# Altium schematic sheet MCU_LCDGlass_Symbol.SchDoc: MCU_LCDGlassl
size A3; DocumentNumber: MB1144; Revision: C-02; SheetNumber: 2; SheetTotal: 25; PageSetup: Record=PageOptions|CenterHorizontal=True|CenterVertical=True|PrintScale=1.01|XCorrection=1.00|YCorrection=1.00|PrintKind=1|BorderSize=5000000|LeftOffset=0|BottomOffset=0|Orientation=2|PaperLength=1000|PaperWidth=1000|Scale=100|PaperSource=264|PrintQuality=600|MediaType=1|DitherType=10|PaperKind=A3|PrintScaleMode=1; Project: STM32L476G-EVAL; ModifiedDate: 9/23/2015
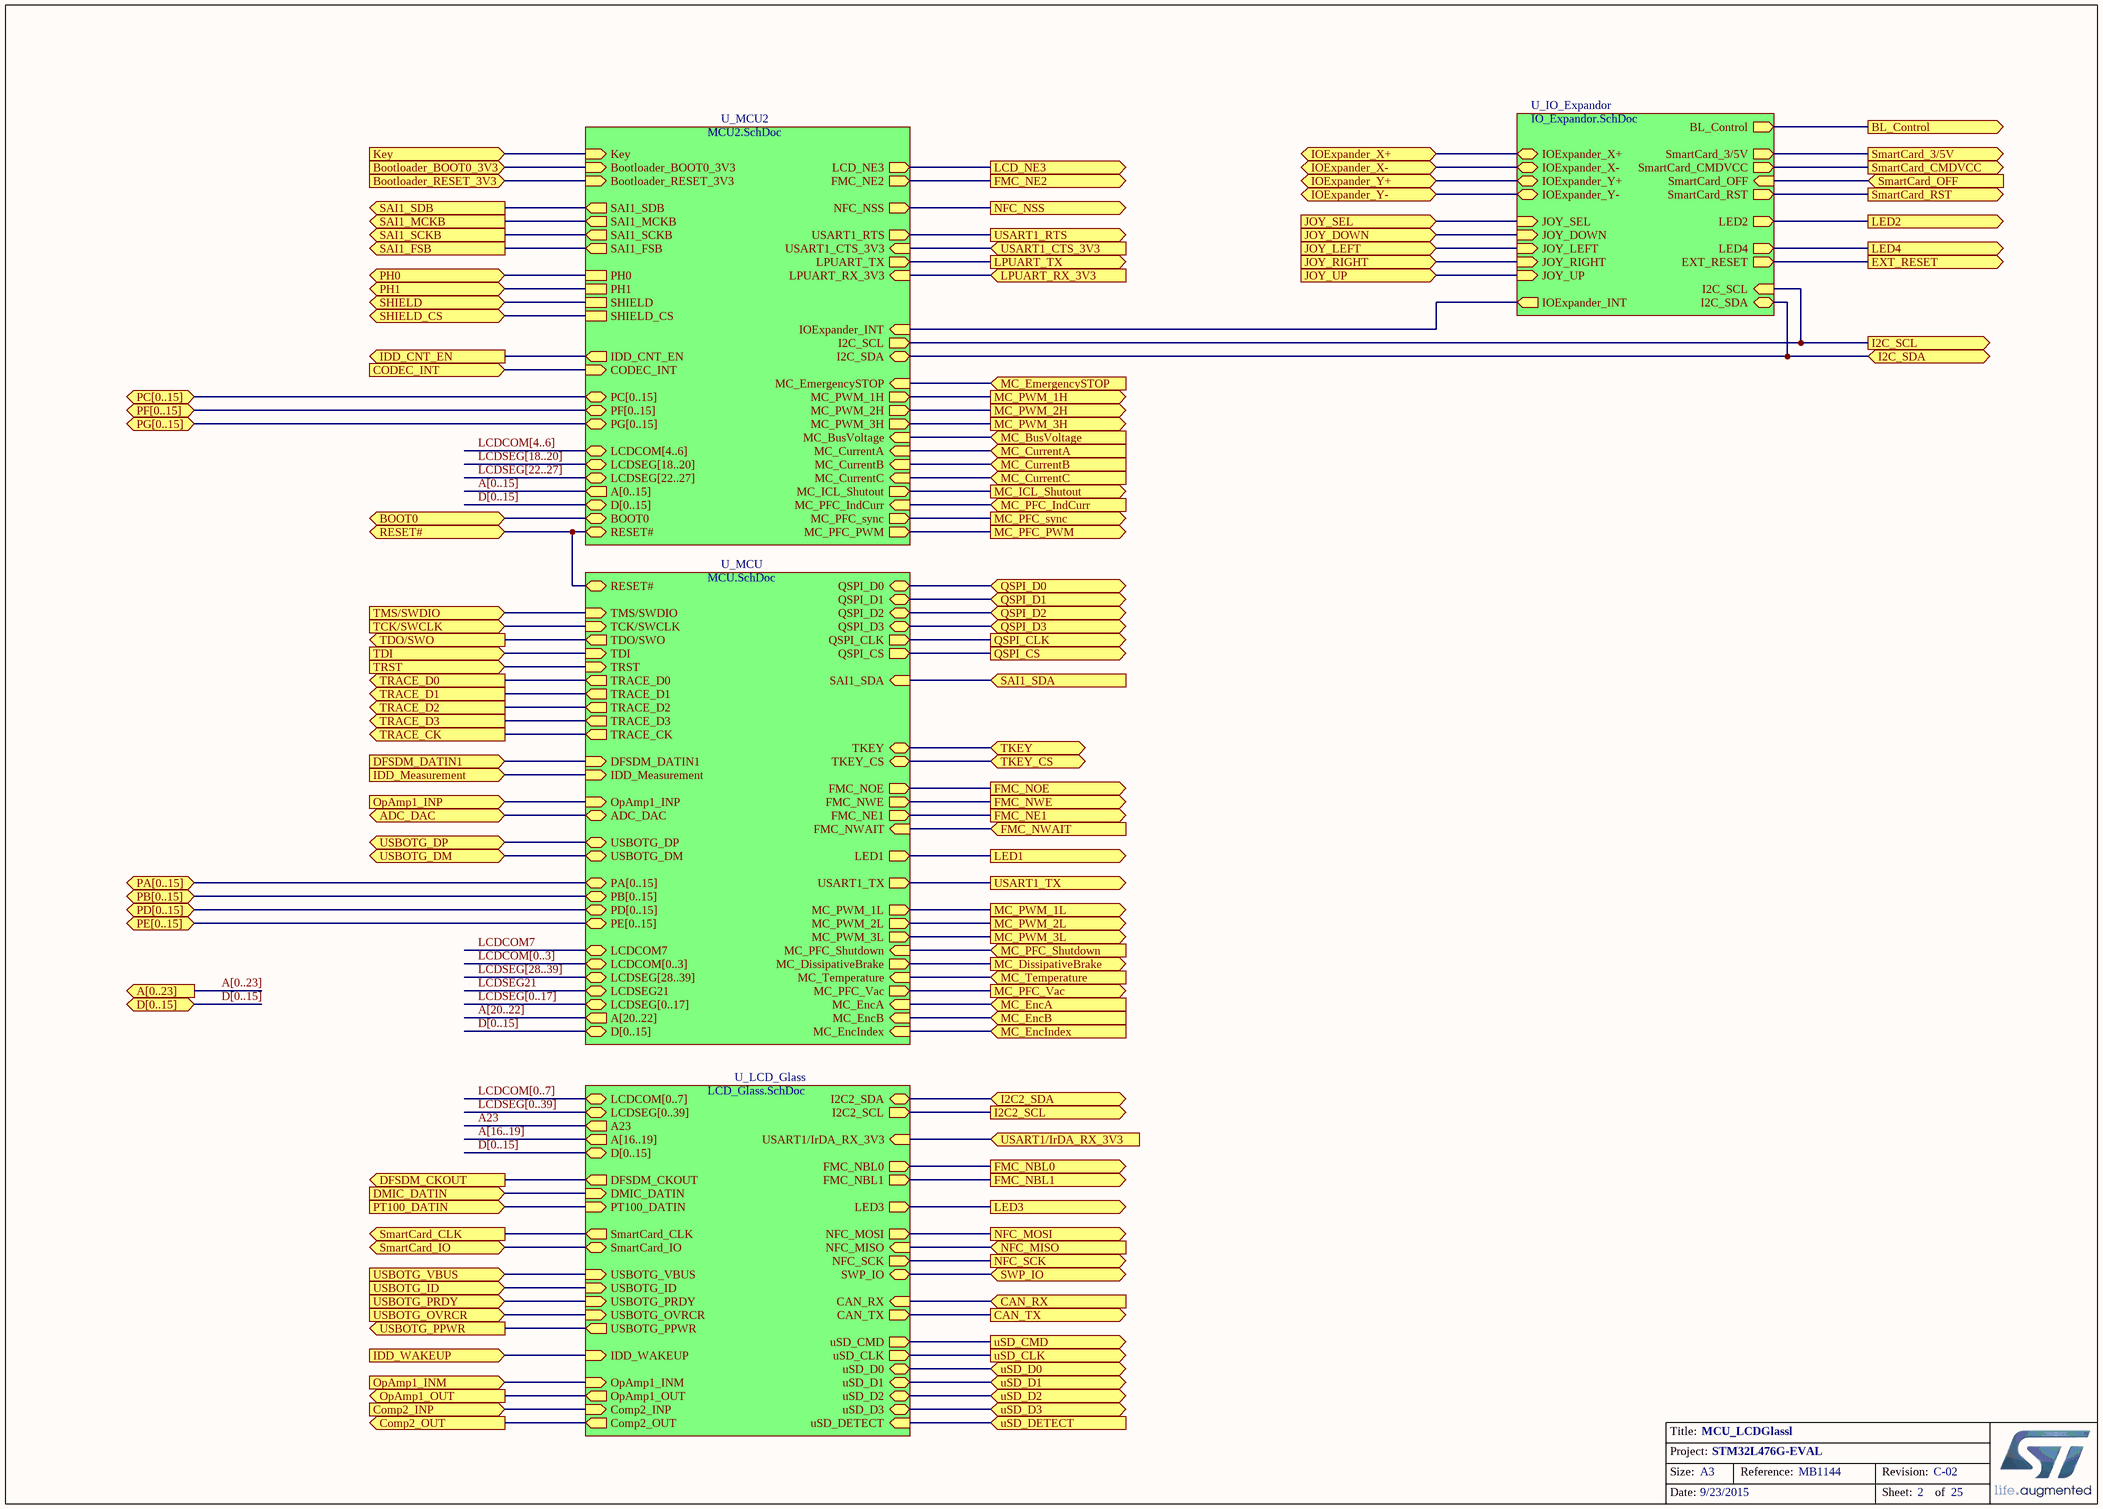
[diagram p0: MCU_LCDGlass_Symbol.SchDoc]

## Sub-sheets
U_IO_Expandor = IO_Expandor.SchDoc: IOExpander_Y+ (bidir), IOExpander_Y- (bidir), IOExpander_X+ (bidir), IOExpander_X- (bidir), IOExpander_INT (out), I2C_SDA (bidir), JOY_SEL (in), JOY_DOWN (in), JOY_LEFT (in), JOY_RIGHT (in), JOY_UP (in), LED4 (out), SmartCard_RST (out), SmartCard_CMDVCC (out), SmartCard_3/5V (out), SmartCard_OFF (in), I2C_SCL (in), LED2 (out), BL_Control (out), EXT_RESET (out)
U_LCD_Glass = LCD_Glass.SchDoc: uSD_CMD (out), uSD_CLK (out), uSD_D3 (bidir), uSD_D2 (bidir), IDD_WAKEUP (in), PT100_DATIN (in), uSD_D0 (bidir), uSD_D1 (bidir), OpAmp1_INM (in), FMC_NBL0 (out), FMC_NBL1 (out), LCDSEG[0..39] (bidir), LCDCOM[0..7] (bidir), USBOTG_VBUS (in), USBOTG_ID (in), CAN_TX (out), SWP_IO (bidir), CAN_RX (in), DMIC_DATIN (in), OpAmp1_OUT (out), Comp2_INP (in), SmartCard_CLK (out), SmartCard_IO (bidir), uSD_DETECT (in), DFSDM_CKOUT (out), D[0..15] (bidir), USBOTG_PRDY (in), USBOTG_OVRCR (in), USBOTG_PPWR (out), Comp2_OUT (out), USART1/IrDA_RX_3V3 (in), A[16..19] (out), A23 (out), NFC_MISO (in), NFC_SCK (out), NFC_MOSI (out), I2C2_SDA (bidir), I2C2_SCL (out), LED3 (out)
U_MCU = MCU.SchDoc: PA[0..15] (bidir), PB[0..15] (bidir), PD[0..15] (bidir), PE[0..15] (bidir), USBOTG_DM (bidir), USBOTG_DP (bidir), TMS/SWDIO (in), TCK/SWCLK (in), DFSDM_DATIN1 (in), FMC_NOE (out), FMC_NWE (out), FMC_NWAIT (in), FMC_NE1 (out), TRACE_D3 (out), TRACE_D1 (out), TRST (in), D[0..15] (bidir), IDD_Measurement (in), USART1_TX (out), LED1 (out), MC_DissipativeBrake (out), TRACE_D2 (out), MC_EncA (in), TDI (in), TDO/SWO (out), ADC_DAC (bidir), RESET# (bidir), QSPI_D3 (bidir), QSPI_D2 (bidir), QSPI_D1 (bidir), QSPI_D0 (bidir), QSPI_CLK (out), QSPI_CS (out), TRACE_D0 (out), TRACE_CK (out), SAI1_SDA (in), OpAmp1_INP (in), MC_PFC_Vac (out), MC_Temperature (in), MC_EncB (in), MC_EncIndex (in), TKEY, TKEY_CS, MC_PWM_1L (out), MC_PWM_2L (out), MC_PWM_3L (out), MC_PFC_Shutdown (in), A[20..22] (out), LCDCOM[0..3] (bidir), LCDCOM7, LCDSEG[0..17] (bidir), LCDSEG[28..39] (bidir), LCDSEG21 (bidir)
U_MCU2 = MCU2.SchDoc: PC[0..15] (bidir), Bootloader_BOOT0_3V3 (in), Bootloader_RESET_3V3 (in), Key (in), CODEC_INT (in), USART1_CTS_3V3 (in), FMC_NE2 (out), USART1_RTS (out), PF[0..15] (bidir), PG[0..15] (bidir), D[0..15] (bidir), MC_PFC_sync (out), IDD_CNT_EN (out), LPUART_TX (out), LPUART_RX_3V3 (in), LCD_NE3 (out), IOExpander_INT (in), I2C_SCL (out), I2C_SDA (bidir), RESET# (bidir), PH1, PH0, SHIELD, SAI1_SDB (out), SAI1_MCKB (out), SAI1_SCKB (out), SAI1_FSB (out), MC_ICL_Shutout (out), MC_PFC_PWM (out), MC_CurrentB (in), MC_CurrentC (in), MC_CurrentA (in), MC_PFC_IndCurr (in), MC_BusVoltage (in), MC_PWM_1H (out), SHIELD_CS, MC_PWM_2H (out), MC_PWM_3H (out), MC_EmergencySTOP (in), A[0..15] (out), LCDSEG[18..20] (bidir), LCDCOM[4..6] (bidir), LCDSEG[22..27] (bidir), BOOT0, NFC_NSS (out)

## Ports
A[0..23] (out), ADC_DAC (bidir), BL_Control (out), BOOT0, Bootloader_BOOT0_3V3 (in), Bootloader_RESET_3V3 (in), CAN_RX (in), CAN_TX (out), CODEC_INT (in), Comp2_INP (in), Comp2_OUT (out), D[0..15] (bidir), DFSDM_CKOUT (out), DFSDM_DATIN1 (in), DMIC_DATIN (in), EXT_RESET (out), FMC_NBL0 (out), FMC_NBL1 (out), FMC_NE1 (out), FMC_NE2 (out), FMC_NOE (out), FMC_NWAIT (in), FMC_NWE (out), I2C2_SCL (out), I2C2_SDA (bidir), I2C_SCL (out), I2C_SDA (bidir), IDD_CNT_EN (out), IDD_Measurement (in), IDD_WAKEUP (in), IOExpander_X+ (bidir), IOExpander_X- (bidir), IOExpander_Y+ (bidir), IOExpander_Y- (bidir), JOY_DOWN (in), JOY_LEFT (in), JOY_RIGHT (in), JOY_SEL (in), JOY_UP (in), Key (in), LCD_NE3 (out), LED1 (out), LED2 (out), LED3 (out), LED4 (out), LPUART_RX_3V3 (in), LPUART_TX (out), MC_BusVoltage (in), MC_CurrentA (in), MC_CurrentB (in), MC_CurrentC (in), MC_DissipativeBrake (out), MC_EmergencySTOP (in), MC_EncA (in), MC_EncB (in), MC_EncIndex (in), MC_ICL_Shutout (out), MC_PFC_IndCurr (in), MC_PFC_PWM (out), MC_PFC_Shutdown (in), MC_PFC_sync (out), MC_PFC_Vac (out), MC_PWM_1H (out), MC_PWM_1L (out), MC_PWM_2H (out), MC_PWM_2L (out), MC_PWM_3H (out), MC_PWM_3L (out), MC_Temperature (in), NFC_MISO (in), NFC_MOSI (out), NFC_NSS (out), NFC_SCK (out), OpAmp1_INM (in), OpAmp1_INP (in), OpAmp1_OUT (out), PA[0..15] (bidir), PB[0..15] (bidir), PC[0..15] (bidir), PD[0..15] (bidir), PE[0..15] (bidir), PF[0..15] (bidir), PG[0..15] (bidir), PH0, PH1, PT100_DATIN (in), QSPI_CLK (out), QSPI_CS (out), QSPI_D0 (bidir), QSPI_D1 (bidir), QSPI_D2 (bidir), QSPI_D3 (bidir), RESET# (bidir), SAI1_FSB (out), SAI1_MCKB (out), SAI1_SCKB (out), SAI1_SDA (in), SAI1_SDB (out), SHIELD, SHIELD_CS, SmartCard_3/5V (out), SmartCard_CLK (out), SmartCard_CMDVCC (out), SmartCard_IO (bidir), SmartCard_OFF (in), SmartCard_RST (out), SWP_IO (bidir), TCK/SWCLK (in), TDI (in), TDO/SWO (out), TKEY, TKEY_CS, TMS/SWDIO (in), TRACE_CK (out), TRACE_D0 (out), TRACE_D1 (out), TRACE_D2 (out), TRACE_D3 (out), TRST (in), USART1/IrDA_RX_3V3 (in), USART1_CTS_3V3 (in), USART1_RTS (out), USART1_TX (out), USBOTG_DM (bidir), USBOTG_DP (bidir), USBOTG_ID (in), USBOTG_OVRCR (in), USBOTG_PPWR (out), USBOTG_PRDY (in), USBOTG_VBUS (in), uSD_CLK (out), uSD_CMD (out), uSD_D0 (bidir), uSD_D1 (bidir), uSD_D2 (bidir), uSD_D3 (bidir), uSD_DETECT (in)

## Nets
A23: sheet U_LCD_Glass/A23
ADC_DAC: port ADC_DAC, sheet U_MCU/ADC_DAC
BL_Control: port BL_Control, sheet U_IO_Expandor/BL_Control
BOOT0: port BOOT0, sheet U_MCU2/BOOT0
Bootloader_BOOT0_3V3: port Bootloader_BOOT0_3V3, sheet U_MCU2/Bootloader_BOOT0_3V3
Bootloader_RESET_3V3: port Bootloader_RESET_3V3, sheet U_MCU2/Bootloader_RESET_3V3
CAN_RX: port CAN_RX, sheet U_LCD_Glass/CAN_RX
CAN_TX: port CAN_TX, sheet U_LCD_Glass/CAN_TX
CODEC_INT: port CODEC_INT, sheet U_MCU2/CODEC_INT
Comp2_INP: port Comp2_INP, sheet U_LCD_Glass/Comp2_INP
Comp2_OUT: port Comp2_OUT, sheet U_LCD_Glass/Comp2_OUT
DFSDM_CKOUT: port DFSDM_CKOUT, sheet U_LCD_Glass/DFSDM_CKOUT
DFSDM_DATIN1: port DFSDM_DATIN1, sheet U_MCU/DFSDM_DATIN1
DMIC_DATIN: port DMIC_DATIN, sheet U_LCD_Glass/DMIC_DATIN
EXT_RESET: port EXT_RESET, sheet U_IO_Expandor/EXT_RESET
FMC_NBL0: port FMC_NBL0, sheet U_LCD_Glass/FMC_NBL0
FMC_NBL1: port FMC_NBL1, sheet U_LCD_Glass/FMC_NBL1
FMC_NE1: port FMC_NE1, sheet U_MCU/FMC_NE1
FMC_NE2: port FMC_NE2, sheet U_MCU2/FMC_NE2
FMC_NOE: port FMC_NOE, sheet U_MCU/FMC_NOE
FMC_NWAIT: port FMC_NWAIT, sheet U_MCU/FMC_NWAIT
FMC_NWE: port FMC_NWE, sheet U_MCU/FMC_NWE
I2C2_SCL: port I2C2_SCL, sheet U_LCD_Glass/I2C2_SCL
I2C2_SDA: port I2C2_SDA, sheet U_LCD_Glass/I2C2_SDA
I2C_SCL: port I2C_SCL, sheet U_IO_Expandor/I2C_SCL, sheet U_MCU2/I2C_SCL
I2C_SDA: port I2C_SDA, sheet U_IO_Expandor/I2C_SDA, sheet U_MCU2/I2C_SDA
IDD_CNT_EN: port IDD_CNT_EN, sheet U_MCU2/IDD_CNT_EN
IDD_Measurement: port IDD_Measurement, sheet U_MCU/IDD_Measurement
IDD_WAKEUP: port IDD_WAKEUP, sheet U_LCD_Glass/IDD_WAKEUP
IOExpander_X+: port IOExpander_X+, sheet U_IO_Expandor/IOExpander_X+
IOExpander_X-: port IOExpander_X-, sheet U_IO_Expandor/IOExpander_X-
IOExpander_Y+: port IOExpander_Y+, sheet U_IO_Expandor/IOExpander_Y+
IOExpander_Y-: port IOExpander_Y-, sheet U_IO_Expandor/IOExpander_Y-
JOY_DOWN: port JOY_DOWN, sheet U_IO_Expandor/JOY_DOWN
JOY_LEFT: port JOY_LEFT, sheet U_IO_Expandor/JOY_LEFT
JOY_RIGHT: port JOY_RIGHT, sheet U_IO_Expandor/JOY_RIGHT
JOY_SEL: port JOY_SEL, sheet U_IO_Expandor/JOY_SEL
JOY_UP: port JOY_UP, sheet U_IO_Expandor/JOY_UP
Key: port Key, sheet U_MCU2/Key
LCD_NE3: port LCD_NE3, sheet U_MCU2/LCD_NE3
LCDCOM7: sheet U_MCU/LCDCOM7
LCDSEG21: sheet U_MCU/LCDSEG21
LED1: port LED1, sheet U_MCU/LED1
LED2: port LED2, sheet U_IO_Expandor/LED2
LED3: port LED3, sheet U_LCD_Glass/LED3
LED4: port LED4, sheet U_IO_Expandor/LED4
LPUART_RX_3V3: port LPUART_RX_3V3, sheet U_MCU2/LPUART_RX_3V3
LPUART_TX: port LPUART_TX, sheet U_MCU2/LPUART_TX
MC_BusVoltage: port MC_BusVoltage, sheet U_MCU2/MC_BusVoltage
MC_CurrentA: port MC_CurrentA, sheet U_MCU2/MC_CurrentA
MC_CurrentB: port MC_CurrentB, sheet U_MCU2/MC_CurrentB
MC_CurrentC: port MC_CurrentC, sheet U_MCU2/MC_CurrentC
MC_DissipativeBrake: port MC_DissipativeBrake, sheet U_MCU/MC_DissipativeBrake
MC_EmergencySTOP: port MC_EmergencySTOP, sheet U_MCU2/MC_EmergencySTOP
MC_EncA: port MC_EncA, sheet U_MCU/MC_EncA
MC_EncB: port MC_EncB, sheet U_MCU/MC_EncB
MC_EncIndex: port MC_EncIndex, sheet U_MCU/MC_EncIndex
MC_ICL_Shutout: port MC_ICL_Shutout, sheet U_MCU2/MC_ICL_Shutout
MC_PFC_IndCurr: port MC_PFC_IndCurr, sheet U_MCU2/MC_PFC_IndCurr
MC_PFC_PWM: port MC_PFC_PWM, sheet U_MCU2/MC_PFC_PWM
MC_PFC_Shutdown: port MC_PFC_Shutdown, sheet U_MCU/MC_PFC_Shutdown
MC_PFC_sync: port MC_PFC_sync, sheet U_MCU2/MC_PFC_sync
MC_PFC_Vac: port MC_PFC_Vac, sheet U_MCU/MC_PFC_Vac
MC_PWM_1H: port MC_PWM_1H, sheet U_MCU2/MC_PWM_1H
MC_PWM_1L: port MC_PWM_1L, sheet U_MCU/MC_PWM_1L
MC_PWM_2H: port MC_PWM_2H, sheet U_MCU2/MC_PWM_2H
MC_PWM_2L: port MC_PWM_2L, sheet U_MCU/MC_PWM_2L
MC_PWM_3H: port MC_PWM_3H, sheet U_MCU2/MC_PWM_3H
MC_PWM_3L: port MC_PWM_3L, sheet U_MCU/MC_PWM_3L
MC_Temperature: port MC_Temperature, sheet U_MCU/MC_Temperature
NFC_MISO: port NFC_MISO, sheet U_LCD_Glass/NFC_MISO
NFC_MOSI: port NFC_MOSI, sheet U_LCD_Glass/NFC_MOSI
NFC_NSS: port NFC_NSS, sheet U_MCU2/NFC_NSS
NFC_SCK: port NFC_SCK, sheet U_LCD_Glass/NFC_SCK
OpAmp1_INM: port OpAmp1_INM, sheet U_LCD_Glass/OpAmp1_INM
OpAmp1_INP: port OpAmp1_INP, sheet U_MCU/OpAmp1_INP
OpAmp1_OUT: port OpAmp1_OUT, sheet U_LCD_Glass/OpAmp1_OUT
PH0: port PH0, sheet U_MCU2/PH0
PH1: port PH1, sheet U_MCU2/PH1
PT100_DATIN: port PT100_DATIN, sheet U_LCD_Glass/PT100_DATIN
QSPI_CLK: port QSPI_CLK, sheet U_MCU/QSPI_CLK
QSPI_CS: port QSPI_CS, sheet U_MCU/QSPI_CS
QSPI_D0: port QSPI_D0, sheet U_MCU/QSPI_D0
QSPI_D1: port QSPI_D1, sheet U_MCU/QSPI_D1
QSPI_D2: port QSPI_D2, sheet U_MCU/QSPI_D2
QSPI_D3: port QSPI_D3, sheet U_MCU/QSPI_D3
RESET#: port RESET#, sheet U_MCU/RESET#, sheet U_MCU2/RESET#
SAI1_FSB: port SAI1_FSB, sheet U_MCU2/SAI1_FSB
SAI1_MCKB: port SAI1_MCKB, sheet U_MCU2/SAI1_MCKB
SAI1_SCKB: port SAI1_SCKB, sheet U_MCU2/SAI1_SCKB
SAI1_SDA: port SAI1_SDA, sheet U_MCU/SAI1_SDA
SAI1_SDB: port SAI1_SDB, sheet U_MCU2/SAI1_SDB
SHIELD: port SHIELD, sheet U_MCU2/SHIELD
SHIELD_CS: port SHIELD_CS, sheet U_MCU2/SHIELD_CS
SmartCard_3/5V: port SmartCard_3/5V, sheet U_IO_Expandor/SmartCard_3/5V
SmartCard_CLK: port SmartCard_CLK, sheet U_LCD_Glass/SmartCard_CLK
SmartCard_CMDVCC: port SmartCard_CMDVCC, sheet U_IO_Expandor/SmartCard_CMDVCC
SmartCard_IO: port SmartCard_IO, sheet U_LCD_Glass/SmartCard_IO
SmartCard_OFF: port SmartCard_OFF, sheet U_IO_Expandor/SmartCard_OFF
SmartCard_RST: port SmartCard_RST, sheet U_IO_Expandor/SmartCard_RST
SWP_IO: port SWP_IO, sheet U_LCD_Glass/SWP_IO
TCK/SWCLK: port TCK/SWCLK, sheet U_MCU/TCK/SWCLK
TDI: port TDI, sheet U_MCU/TDI
TDO/SWO: port TDO/SWO, sheet U_MCU/TDO/SWO
TKEY: port TKEY, sheet U_MCU/TKEY
TKEY_CS: port TKEY_CS, sheet U_MCU/TKEY_CS
TMS/SWDIO: port TMS/SWDIO, sheet U_MCU/TMS/SWDIO
TRACE_CK: port TRACE_CK, sheet U_MCU/TRACE_CK
TRACE_D0: port TRACE_D0, sheet U_MCU/TRACE_D0
TRACE_D1: port TRACE_D1, sheet U_MCU/TRACE_D1
TRACE_D2: port TRACE_D2, sheet U_MCU/TRACE_D2
TRACE_D3: port TRACE_D3, sheet U_MCU/TRACE_D3
TRST: port TRST, sheet U_MCU/TRST
USART1/IrDA_RX_3V3: port USART1/IrDA_RX_3V3, sheet U_LCD_Glass/USART1/IrDA_RX_3V3
USART1_CTS_3V3: port USART1_CTS_3V3, sheet U_MCU2/USART1_CTS_3V3
USART1_RTS: port USART1_RTS, sheet U_MCU2/USART1_RTS
USART1_TX: port USART1_TX, sheet U_MCU/USART1_TX
USBOTG_DM: port USBOTG_DM, sheet U_MCU/USBOTG_DM
USBOTG_DP: port USBOTG_DP, sheet U_MCU/USBOTG_DP
USBOTG_ID: port USBOTG_ID, sheet U_LCD_Glass/USBOTG_ID
USBOTG_OVRCR: port USBOTG_OVRCR, sheet U_LCD_Glass/USBOTG_OVRCR
USBOTG_PPWR: port USBOTG_PPWR, sheet U_LCD_Glass/USBOTG_PPWR
USBOTG_PRDY: port USBOTG_PRDY, sheet U_LCD_Glass/USBOTG_PRDY
USBOTG_VBUS: port USBOTG_VBUS, sheet U_LCD_Glass/USBOTG_VBUS
uSD_CLK: port uSD_CLK, sheet U_LCD_Glass/uSD_CLK
uSD_CMD: port uSD_CMD, sheet U_LCD_Glass/uSD_CMD
uSD_D0: port uSD_D0, sheet U_LCD_Glass/uSD_D0
uSD_D1: port uSD_D1, sheet U_LCD_Glass/uSD_D1
uSD_D2: port uSD_D2, sheet U_LCD_Glass/uSD_D2
uSD_D3: port uSD_D3, sheet U_LCD_Glass/uSD_D3
uSD_DETECT: port uSD_DETECT, sheet U_LCD_Glass/uSD_DETECT
(unnamed): sheet U_IO_Expandor/IOExpander_INT, sheet U_MCU2/IOExpander_INT

## Buses and harness runs
bus A[0..15] = sheet U_MCU2/A[0..15]
bus A[0..23] = port A[0..23]
bus A[16..19] = sheet U_LCD_Glass/A[16..19]
bus A[20..22] = sheet U_MCU/A[20..22]
bus D[0..15] = port D[0..15]
bus D[0..15] = sheet U_LCD_Glass/D[0..15]
bus D[0..15] = sheet U_MCU2/D[0..15]
bus D[0..15] = sheet U_MCU/D[0..15]
bus LCDCOM[0..3] = sheet U_MCU/LCDCOM[0..3]
bus LCDCOM[0..7] = sheet U_LCD_Glass/LCDCOM[0..7]
bus LCDCOM[4..6] = sheet U_MCU2/LCDCOM[4..6]
bus LCDSEG[0..17] = sheet U_MCU/LCDSEG[0..17]
bus LCDSEG[0..39] = sheet U_LCD_Glass/LCDSEG[0..39]
bus LCDSEG[18..20] = sheet U_MCU2/LCDSEG[18..20]
bus LCDSEG[22..27] = sheet U_MCU2/LCDSEG[22..27]
bus LCDSEG[28..39] = sheet U_MCU/LCDSEG[28..39]
bus port PA[0..15] = sheet U_MCU/PA[0..15]
bus port PB[0..15] = sheet U_MCU/PB[0..15]
bus port PC[0..15] = sheet U_MCU2/PC[0..15]
bus port PD[0..15] = sheet U_MCU/PD[0..15]
bus port PE[0..15] = sheet U_MCU/PE[0..15]
bus port PF[0..15] = sheet U_MCU2/PF[0..15]
bus port PG[0..15] = sheet U_MCU2/PG[0..15]

## Notes on the sheet
- Title:
- Project:
- Size:
- Date:
- A3
- Reference:
- Sheet:
- Revision:
- of